# EAGLE design stitchies_v2_print (EAGLE 5.11)
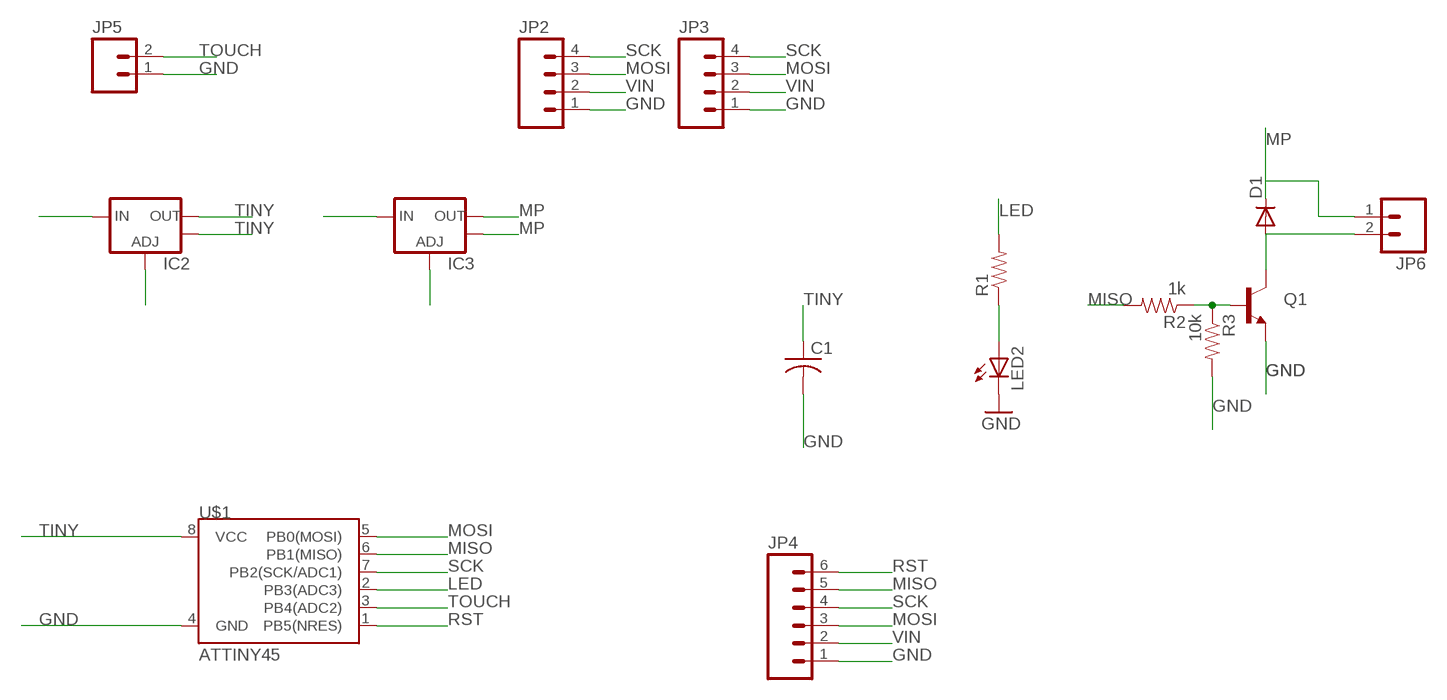
[diagram p0: schematic, sheet 1]

## Parts
C1  C-USC0805  [C0805]
D1  DIODESOD  [SOD-323]
IC2  V_REG_LM1117SOT223  [SOT223]
IC3  V_REG_LM1117SOT223  [SOT223]
JP2  M04PTH  [1X04]
JP3  M04PTH  [1X04]
JP4  M06LOCK  [1X06_LOCK]
JP5  M02PTH  [1X02]
JP6  M02PTH  [1X02]
LED2  LED1206  [LED-1206]
Q1  TRANSISTOR_NPNSOT23-3  [SOT23-3]
R1  RESISTOR0805-RES  [0805]
R2  1k  RESISTOR0805-RES  [0805]
R3  10k  RESISTOR0805-RES  [0805]
U$1  ATTINY45  [SO08-EIAJ]

## Nets
GND: C1.2 IC2.1(ADJ) IC3.1(ADJ) JP2.1 JP3.1 JP4.1 JP5.1 LED2.C Q1.2(E) R3.2 U$1.4(GND)
LED: R1.2 U$1.2(PB3(ADC3))
MISO: JP4.5 R2.2 U$1.6(PB1(MISO))
MOSI: JP2.3 JP3.3 JP4.3 U$1.5(PB0(MOSI))
MP: D1.1(C) IC3.2(OUT) IC3.4(OUT) JP6.1
N$1: LED2.A R1.1
N$2: D1.2(A) JP6.2 Q1.3(C)
N$7: Q1.1(B) R2.1 R3.1
RST: JP4.6 U$1.1(PB5(NRES))
SCK: JP2.4 JP3.4 JP4.4 U$1.7(PB2(SCK/ADC1))
TINY: C1.1 IC2.2(OUT) IC2.4(OUT) U$1.8(VCC)
TOUCH: JP5.2 U$1.3(PB4(ADC2))
VIN: IC2.3(IN) IC3.3(IN) JP2.2 JP3.2 JP4.2

## Library data of the parts
C1 = rcl:C-US: CAPACITOR, American symbol
D1 = SparkFun:DIODE: Diode These are standard reverse protection diodes and small signal diodes. SMA package can handle up to about 1A. SOD-323 can handle about 200mA. What the SOD-323 package when ordering, there are some mfgs out there that are 5-pin packages.
IC2 IC3 = SparkFun:V_REG_LM1117: Voltage Regulator LM1117 Standard adjustable voltage regulator but in SMD form. Spark Fun Electronics SKU : COM-00595
JP2 JP3 = SparkFun:M04: Header 4 Standard 4-pin 0.1" header. Use with straight break away headers (SKU : PRT-00116), right angle break away headers (PRT-00553), swiss pins (PRT-00743), machine pins (PRT-00117), and female headers (PRT-00115). Molex polarized connector foot print use with SKU : PRT-08231 with associated crimp pins and housings. 1MM SMD Version SKU: PRT-10208
JP4 = SparkFun:M06: Header 6 Standard 6-pin 0.1" header. Use with straight break away headers (SKU : PRT-00116), right angle break away headers (PRT-00553), swiss pins (PRT-00743), machine pins (PRT-00117), and female headers (PRT-00115). Molex polarized connector foot print use with SKU : PRT-08094 with associated crimp pins and housings. NOTES ON THE VARIANTS LOCK and LOCK_LONGPADS... This footprint was designed to help hold the alignment of a through-hole component (i.e. 6-pin header) while soldering it into place. You may notice that each hole has been shifted either up or down by 0.005 of an inch from it's more standard position (which is a perfectly straight line). This slight alteration caused the pins (the squares in the middle) to touch the edges of the holes. Because they are alternating, it causes a "brace" to hold the component in place. 0.005 has proven to be the perfect amount of "off-center" position when using our standard breakaway headers. Although looks a little odd when you look at the bare footprint, once you have a header in there, the alteration is very hard to notice. Also, if you push a header all the way into place, it is covered up entirely on the bottom side. This idea of altering the position of holes to aid alignment will be further integrated into the Sparkfun Library for other footprints. It can help hold any component with 3 or more connection pins.
JP5 JP6 = SparkFun:M02: Header 2 Standard 2-pin 0.1" header. Use with straight break away headers (SKU : PRT-00116), right angle break away headers (PRT-00553), swiss pins (PRT-00743), machine pins (PRT-00117), and female headers (PRT-00115). Molex polarized connector foot print use with SKU : PRT-08233 with associated crimp pins and housings.
LED2 = LilyPad-Wearables:LED: LEDs Standard schematic elements and footprints for 5mm, 3mm, 1206, and 0603 sized LEDs. 5mm - Spark Fun Electronics SKU : Comp-SBL
Q1 = SparkFun:TRANSISTOR_NPN: Transistor NPN BJT configuration in SOT23 package. MMBT2222 is the common NPN we use. Double check BCE configuration again layout.
R1-R3 = SparkFun:RESISTOR: Resistor Basic schematic elements and footprints for 0603, 1206, and PTH resistors.
U$1 = SparkFun:ATTINY45: Atmel ATTiny45

## Board
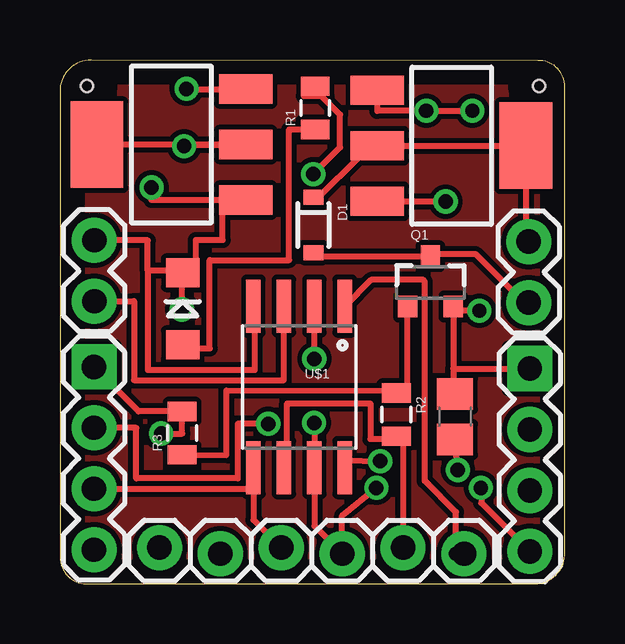
[diagram p1: board, top side]
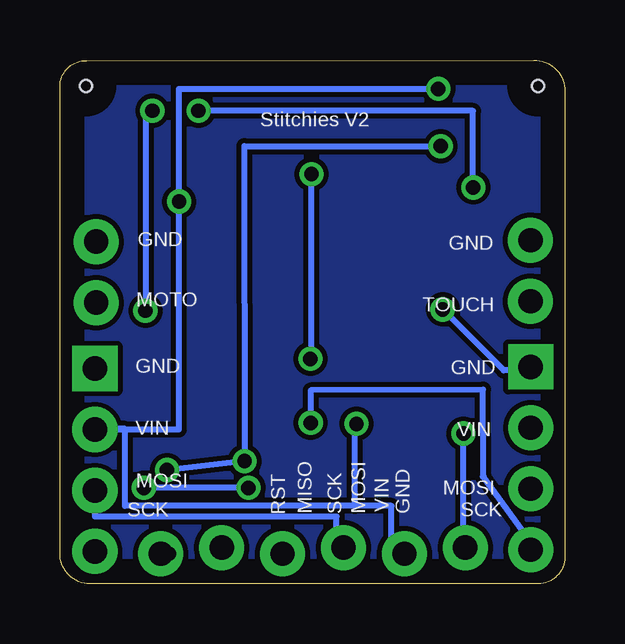
[diagram p2: board, bottom side, seen from below]

Size 21.05 x 21.82 mm. Coordinates in mm from the lower left corner, seen from the top.
Outline: 0.01,1.21 arc96 1.1,0 19.82,0 arc93 21.04,1.3 21.05,20.72 arc92 19.93,21.8 1.3,21.82 arc90 0,20.52 0.01,1.21
Copper layers (1*16): Top 0.035mm / dielectric 1.5mm / Bottom 0.035mm
Design rules "default": minimum track width 10mil, minimum drill 24mil, track to track 8mil, track to pad 8mil, pad to pad 8mil, via to via 8mil, smd to smd 8mil, copper to edge 40mil, drill to drill 8mil, minimum pad ring 10mil, minimum via ring 8mil, stop-mask expansion 4mil, vias tented up to drill 0mil, thermal gap 10mil
Holes 0.5 mm at 19.97,20.74 1.12,20.74

### Footprints (pad centres in the part's own frame; a part is rotated, then mirrored left to right if it is on the bottom)
C0805 = smd 1.3 x 1.5: 1 -0.95,0; 2 0.95,0
SOD-323 = smd 0.63 x 0.83: 1 -1.15,0; 2 1.15,0
SOT223 = smd 1.219 x 2.235: 1 -2.311,-3.099; 2 0,-3.099; 3 2.311,-3.099 | smd 3.6 x 2.2: 4 0,3.099
1X04 = drill 1.016 pad 1.88 square: 1 0,0 | drill 1.016 pad 1.88 round: 2 2.54,0; 3 5.08,0; 4 7.62,0
1X06_LOCK = drill 1.016 pad 1.88 round: 1 0,0; 2 2.54,-0.254; 3 5.08,0; 4 7.62,-0.254; 5 10.16,0; 6 12.7,-0.254
1X02 = drill 1.016 pad 1.88 round: 1 0,0; 2 2.54,0
LED-1206 = smd 1.2 x 1.4: A -1.5,0; C 1.5,0
SOT23-3 = smd 0.8 x 0.9: 1 -0.95,-1; 2 0.95,-1; 3 0,1.1
0805 = smd 0.8 x 1.2: 1 -0.9,0; 2 0.9,0
SO08-EIAJ = smd 0.61 x 2.21: 1 -1.905,-3.378; 2 -0.635,-3.378; 3 0.635,-3.378; 4 1.905,-3.378; 5 1.905,3.353; 6 0.635,3.353; 7 -0.635,3.353; 8 -1.905,3.353

### Placement (x,y rotation side)
C1  16.47,6.96 90 top
D1  10.57,14.95 270 top
IC2  4.64,18.3 90 top
IC3  16.33,18.25 270 top
JP2  19.59,8.97 270 top
JP3  1.42,9.04 270 top
JP4  4.15,1.5 0 top
JP5  1.43,14.31 270 top
JP6  19.54,14.25 270 top
LED2  5.12,11.46 90 top
Q1  15.45,12.55 0 top
R1  10.65,19.83 90 top
R2  14.03,7.05 270 top
R3  5.1,6.28 90 top
U$1  9.97,8.19 180 top

### Tracks (layer width: path | path; a pad name or v marks a point on that pad's centre or on a via)
GND  (via drill 0.6, 0.61)
  Top 0.254: 16.4,8.97 Q1.2 16.4,11.37 v17.49,11.37 | 16.53,7.89 16.53,7.91 C1.2 16.4,7.91 16.4,8.97 | 16.4,8.97 JP2.1 | LED2.C 5.67,12.96 5.67,14.33 6.79,14.33 6.79,15.99 IC2.1 3.82,15.99 v3.82,16.51 | U$1.4 8.13,11.56 8.13,8.91 3.67,8.91 3.67,13.05 | 3.67,13.05 5.12,13.05 LED2.C | JP5.1 3.67,14.31 3.67,13.05 | v4.22,6.26 5.1,6.26 R3.2 3.28,7.18 JP3.1 | IC3.1 13.23,19.71 v15.28,19.71 v17.2,19.71 | v5.09,11.43 5.09,12.7 LED2.C
  Bottom 0.254: JP4.1 4.22,1.5 v4.22,6.26 | v3.82,16.51 3.83,16.51 3.83,19.71 v15.28,19.71 | v5.09,11.43 2.55,8.89 1.28,8.89 JP3.1 | v17.2,19.71 17.49,19.71 v17.49,11.37
LED  (via drill 0.6)
  Top 0.254: R1.2 10.57,20.73 10.17,20.32 10.9,20.32 11.68,19.55 11.68,18.19 v10.56,17.07 | v10.61,9.37 U$1.2
  Bottom 0.254: v10.56,17.07 10.56,9.41 v10.61,9.37
MISO
  Top 0.254: JP4.5 14.31,6.15 R2.2 14.02,6.04 12.94,6.04 12.94,7.51 9.48,7.51 9.48,4.83 U$1.6
MOSI
  Top 0.254: 8.07,3.96 U$1.5 | JP4.3 8.07,2.66 8.07,3.96 | JP3.3 8.07,3.96
  Bottom 0.254: JP4.3 9.51,1.5 9.51,2.79 19.59,2.79 JP2.3
MP
  Top 0.254: D1.1 10.79,16.1 12.46,17.77 12.75,17.77 IC3.2 IC3.4 19.43,14.36 JP6.1
N$1
  Top 0.254: R1.1 9.55,18.93 9.55,13.48 6.25,13.48 6.25,9.8 5.12,9.8 LED2.A
N$2
  Top 0.254: JP6.2 19.35,11.71 17.32,13.75 15.54,13.75 Q1.3 10.71,13.65 D1.2
N$3
  pour Top: 0.01,21.59 20.9,21.59 20.9,18.45 20.93,18.45 20.93,0.12 0.25,0.12 0.25,21.51
N$4
  pour Bottom: 0.01,21.59 20.87,21.59 20.87,20.72 20.87,0.18 -0.05,0.18 -0.05,21.68
N$7
  Top 0.254: R3.1 6.94,5.36 6.94,8.05 14.02,8.06 R2.1 14.5,7.95 Q1.1
RST  (via drill 0.6)
  Top 0.254: v16.52,1.25 16.52,2.98 15.21,4.28 15.21,12.59 15.15,12.66 12.97,12.66 U$1.1
  Bottom 0.254: JP4.6 v16.52,1.25 16.52,1.27
SCK  (via drill 0.6)
  Top 0.254: v13.19,3.99 11.77,2.84 JP4.4 10.61,2.41 U$1.7 10.61,6.55 v10.6,6.7 | v17.55,3.99 17.57,3.37 JP2.4
  Bottom 0.254: v13.19,3.99 v17.55,3.99 | JP3.4 1.42,1.73 3.42,4.47 3.39,4.48 3.41,8.09 10.6,8.06 v10.6,6.7
TINY  (via drill 0.6)
  Top 0.254: IC2.4 IC2.2 5.19,18.3 v5.18,18.23 | v13.36,5.11 11.86,5.15 U$1.8 | C1.1 v16.59,4.74
  Bottom 0.254: v5.18,18.23 13.36,18.23 13.34,5.11 13.4,5.1 | 13.4,5.1 v16.59,4.74 | v13.36,5.11 13.4,5.1
TOUCH
  Top 0.254: JP5.2 3.09,11.77 3.09,8.48 9.34,8.48 U$1.3
VIN  (via drill 0.6)
  Top 0.254: v16.08,15.92 13.23,15.92 IC3.3 | IC2.3 5.28,20.61 v5.28,20.62 | JP3.2 3.18,6.5 3.18,4.39 7.41,4.39 7.41,6.66 v8.69,6.66
  Bottom 0.254: JP4.2 7.22,1.25 7.22,3.25 8.76,3.25 | 8.76,3.25 18.34,3.25 18.34,6.45 19.59,6.45 JP2.2 16.08,6.43 v16.08,15.92 16.08,20.62 v5.28,20.62 | v8.69,6.66 8.76,6.66 8.76,3.25

### Text on the board
bNames: Stitchies V2 | GND | GND | MOTO | TOUCH | GND | GND | VIN | VIN | GND | MOSI | SCK | MISO | RST | MOSI | VIN | MOSI | SCK | SCK